# Altium schematic sheet page1.SchDoc
size 420 x 297 mm; Author: Шпаков Д.; Address1: Address1; Address2: Address2; Address3: Address3; Address4: Address4; DocumentNumber: SolMPPT.0.0.1; SheetNumber: 1; Scale: 1:1; DocumentType: Схема электрическая принципиальная; FirstReferrence: SolMPPT.0.0.1
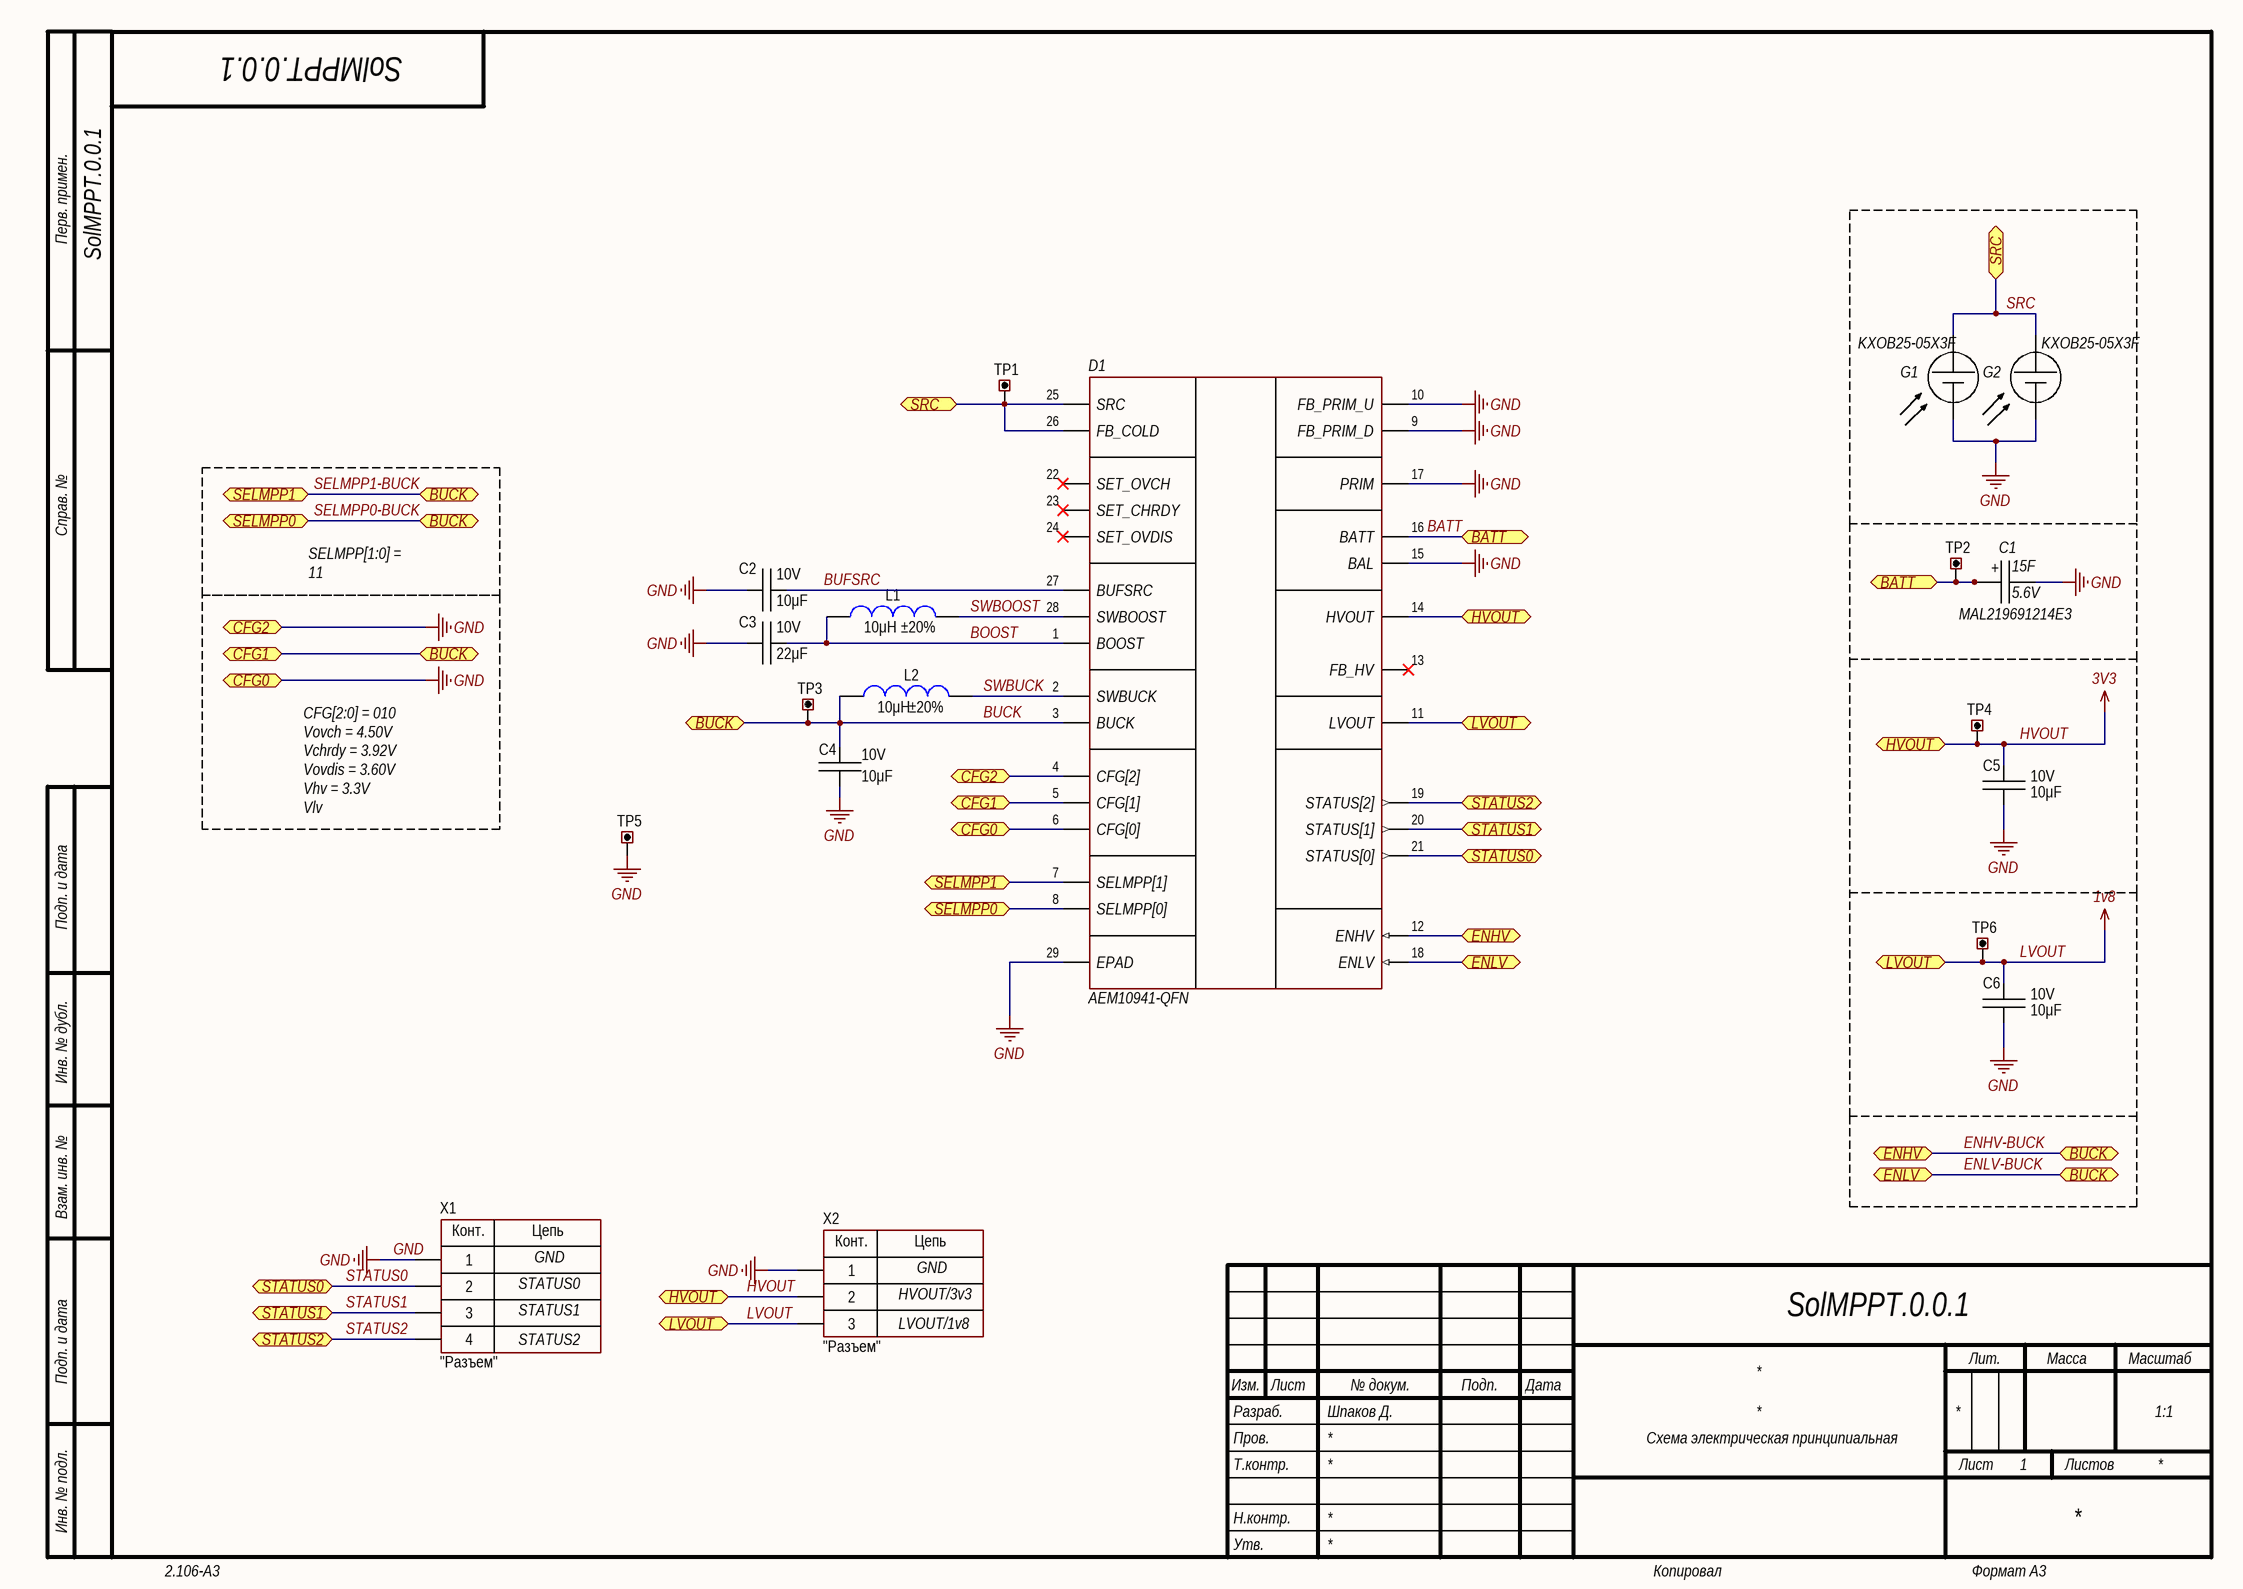
[diagram p0: page1.SchDoc]

## Parts
C1  15F  Voltage: 5.6V  [MAL219691214E3]
C2  value 10μF  Voltage: 10V  [CAP: 0603]
C3  value 22μF  Voltage: 10V  [CAP: 0603]
C4  value 10μF  Voltage: 10V  [CAP: 0603]
C5  value 10μF  Voltage: 10V  [CAP: 0603]
C6  value 10μF  Voltage: 10V  [CAP: 0603]
D1  AEM10941-QFN  [QFN50P500X500X85_HS-29N]
G1  KXOB25-05X3F  [KXOB25-05X3F]
G2  KXOB25-05X3F  [KXOB25-05X3F]
L1  value 10μH  Tolerance: ±20%  [IND: SDR0302]
L2  value 10μH  Tolerance: ±20%  [IND: 0603]
TP1  (no value)  [CON: 5000 (Keystone)]
TP2  (no value)  [CON: 5000 (Keystone)]
TP3  (no value)  [CON: 5000 (Keystone)]
TP4  (no value)  [CON: 5000 (Keystone)]
TP5  (no value)  [CON: 5000 (Keystone)]
TP6  (no value)  [CON: 5000 (Keystone)]
X1  CommentText: "Разъем"  [CON: PLS-4]
X2  CommentText: "Разъем"  [CON: PLS-3]

## Ports
BATT, BUCK, CFG0, CFG1, CFG2, ENHV, ENLV, HVOUT, LVOUT, SELMPP0, SELMPP1, SRC, STATUS0, STATUS1, STATUS2

## Nets
GND: C1.2 C2.1 C3.2 C4.2 C5.2 C6.2 D1.4(CFG[2]) D1.6(CFG[0]) D1.9(FB_PRIM_D) D1.10(FB_PRIM_U) D1.15(BAL) D1.17(PRIM) D1.29(EPAD) G1.2 G2.2 TP5.1 X1.1 X2.1 ; port CFG2, port CFG0
HVOUT: C5.1 D1.14(HVOUT) TP4.1 X2.2 ; port HVOUT  [also labelled 3V3]
LVOUT: C6.1 D1.11(LVOUT) TP6.1 X2.3 ; port LVOUT  [also labelled 1v8]
BATT: C1.1 C1.1a D1.16(BATT) TP2.1 ; port BATT
BOOST: C3.1 D1.1(BOOST) L1.2
BUCK: C4.1 D1.3(BUCK) D1.5(CFG[1]) D1.7(SELMPP[1]) D1.8(SELMPP[0]) D1.12(ENHV) D1.18(ENLV) L2.2 TP3.1 ; port CFG1, port ENLV, port SELMPP1, port SELMPP0, port BUCK, port ENHV  [also labelled ENHV-BUCK, ENLV-BUCK, SELMPP0-BUCK, SELMPP1-BUCK]
BUFSRC: C2.2 D1.27(BUFSRC)
SRC: D1.25(SRC) D1.26(FB_COLD) G1.1 G2.1 TP1.1 ; port SRC
STATUS0: D1.21(STATUS[0]) X1.2 ; port STATUS0
STATUS1: D1.20(STATUS[1]) X1.3 ; port STATUS1
STATUS2: D1.19(STATUS[2]) X1.4 ; port STATUS2
SWBOOST: D1.28(SWBOOST) L1.1
SWBUCK: D1.2(SWBUCK) L2.1

Not connected (* = marked no-connect by the designer): D1 13(FB_HV)* 22(SET_OVCH)* 23(SET_CHRDY)* 24(SET_OVDIS)*

## Notes on the sheet
- SELMPP[1:0] = 11
  Vmpp/Voc = 90%
- CFG[2:0] = 010
  Vovch = 4.50V
  Vchrdy = 3.92V
  Vovdis = 3.60V
  Vhv = 3.3V
  Vlv
  = 1.8V
- GND
- STATUS1
- STATUS0
- LVOUT/1v8
- HVOUT/3v3
- STATUS2
- Перв. примен.
- Справ. №
- Подп. и дата
- Инв. № дубл.
- Взам. инв. №
- Разраб.
- Изм.
- Лист
- № докум.
- Подп.
- Дата
- Лит.
- Масса
- Масштаб
- Пров.
- Т.контр.
- Листов
- Инв. № подл.
- Утв.
- Н.контр.
- 2.106-A3
- Копировал
- Формат А3
- (in symbol MAL219691214E3) +
- (in symbol PLS-3) Конт.; Цепь
- (in symbol PLS-4) Конт.; Цепь

## Library data of the parts
C1 = MAL219691214E3: CAP 15F -20% +80% 5.6V T/H; Manufacturer: Vishay Beyschlag/Draloric/BC Components; Kind: Supercapacitor; ESR: 2.4Ohm @ 1kHz; Lifetime: 1000Hrs @ 85C; Value: 15F; MountingType: TH; Package: Coin, Stacked Horizontal; OperatingTemperature: -20...85C; PartNumber: MAL219691214E3
C2 C4-C6 = Ceramic_0603: Manufacturer: Murata Electronics; PartNumber: GRM188R61A106ME69D; ValueManufacturerPartNumber: Ceramic capacitor, 10μF, X5R, ±20%, 10V, 0603, -55...+85°C; TypeCapacitor: Ceramic capacitor; Tolerance: ±20%; TypeDielectric: X5R; Package: 0603; HelpURL: https://www.digikey.com/en/products/detail/murata-electronics/GRM188R61A106ME69D/5027560; Temperature: -55...+85°C
C3 = Ceramic_0603: Manufacturer: Murata Electronics; PartNumber: GRM188R61A226ME15D; ValueManufacturerPartNumber: Ceramic capacitor, 22μF, X5R, ±20%, 10V, 0603, -55...+85°C; TypeCapacitor: Ceramic capacitor; Tolerance: ±20%; TypeDielectric: X5R; Package: 0603; HelpURL: https://www.digikey.com/en/products/detail/murata-electronics/GRM188R61A226ME15D/5027561; Temperature: -55...+85°C
D1 = AEM10941: Power Management Specialised - PMIC AEM10941 IC - Photovoltaic Energy Harvesting Manager.; Manufacturer: e-peas; OperationTemperature: -40...+125°C; Case: QFN-28; PartNumber: AEM10941-QFN; HelpURL: https://eu.mouser.com/ProductDetail/e-peas/AEM10941-QFN/?qs=W%2FMpXkg%252BdQ7CeqB2lBPbRQ%3D%3D; Type: Photovoltaic Energy Harvesting Manager
G1 G2 = KXOB25-05X3F: Monocrystalline solar cell.; Manufacturer: ANYSOLAR Ltd; Voc: 2.07V; Isc: 19.5mA; Vmpp: 1.67V; Impp: 18.4mA; Pmpp: 30.7mW; Efficiency: 25%; PartNumber: KXOB25-05X3F; HelpURL: https://waf-e.dubudisk.com/anysolar.dubuplus.com/anonymous/O18AjDa/DubuDisk/public/KXOB25-05X3F%20DATA%20SHEET%20202007.pdf; ComponentKind: *
L1 = Inductor_SDR0302: Manufacturer: Bourns; PartNumber: SDR0302-100ML; ValueManufacturerPartNumber: Fixed inductor, 10μH, ±20%, SDR0302, 900mA, -40...+125°C; TypeInductor: Fixed inductor; MaxCurrent: 900mA; Package: SDR0302; HelpURL: https://www.digikey.com/product-detail/en/bourns-inc/SDR0302-100ML/SDR0302-100MLCT-ND/2127048; Temperature: -40...+125°C
L2 = Inductor_0603: Manufacturer: TDK Corporation; PartNumber: MLZ1608M100WT000; ValueManufacturerPartNumber: Fixed inductor, 10μH, ±20%, 0603, 250mA, -55...+125°C; TypeInductor: Fixed inductor; MaxCurrent: 250mA; Package: 0603; HelpURL: https://www.digikey.com/en/products/detail/tdk-corporation/MLZ1608M100WT000/2465148; Temperature: -55...+125°C
TP1-TP6 = Connector_Test_Point: Manufacturer: Keystone; ValueManufacturerPartNumber: Test point, Keystone, 5001; PartNumber: 5001; TypeConnector: Test point; HelpURL: https://www.digikey.com/product-detail/en/keystone-electronics/5001/36-5001-ND/255327
X1 = PLS-4: Manufacturer: Connfly; ValueManufacturerPartNumber: Connector, 4pin, 2.54mm, 500VAC, 3A; TypeConnector: Connector; VoltageMax: 500VAC; Pitch: 2.54mm; CurrentMax: 3A; Multichannel: 4pin; HelpURL: https://www.chipdip.ru/product/pls-4; PartNumber: PLS-4
X2 = PLS-3: Manufacturer: Connfly; ValueManufacturerPartNumber: Connector, 3pin, 2.54mm, 500VAC, 3A; TypeConnector: Connector; VoltageMax: 500VAC; Pitch: 2.54mm; CurrentMax: 3A; Multichannel: 3pin; HelpURL: https://www.chipdip.ru/product/pls-3; PartNumber: PLS-3